# Altium schematic sheet ALU_ZF.SchDoc
size B; Author: E. Sims; Organization: Let's Build Rockets Inc.; SheetNumber: 16; SheetTotal: 16
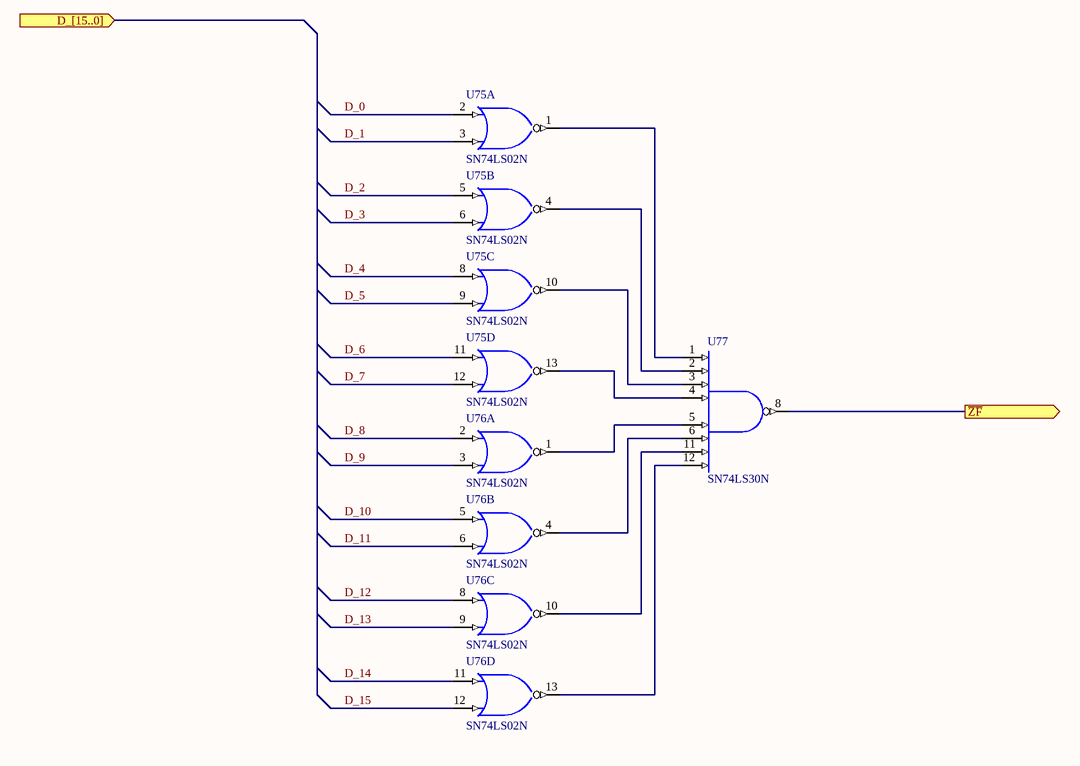
[diagram p0: ALU_ZF.SchDoc]

## Parts
U75  SN74LS02N  [N014]  (parts A,B,C,D of 4)
U76  SN74LS02N  [N014]  (parts A,B,C,D of 4)
U77  SN74LS30N  [N014]

## Ports
D_[15..0] (in), ~{ZF} (out)

## Nets
GND: U75.7(GND) U76.7(GND) U77.7(GND)
VCC: U75.14(VCC) U76.14(VCC) U77.14(VCC)
D_0: U75.2(A)
D_1: U75.3(B)
D_2: U75.5(A)
D_3: U75.6(B)
D_4: U75.8(A)
D_5: U75.9(B)
D_6: U75.11(A)
D_7: U75.12(B)
D_8: U76.2(A)
D_9: U76.3(B)
D_10: U76.5(A)
D_11: U76.6(B)
D_12: U76.8(A)
D_13: U76.9(B)
D_14: U76.11(A)
D_15: U76.12(B)
~{ZF}: U77.8(Y) ; port ~{ZF}
NetU75_1: U75.1(Y) U77.1(A)
NetU75_4: U75.4(Y) U77.2(B)
NetU75_10: U75.10(Y) U77.3(C)
NetU75_13: U75.13(Y) U77.4(D)
NetU76_1: U76.1(Y) U77.5(E)
NetU76_4: U76.4(Y) U77.6(F)
NetU76_10: U76.10(Y) U77.11(G)
NetU76_13: U76.13(Y) U77.12(H)

## Notes on the sheet
- Let's Build Rocket's Inc. Modular Paylaod System Based on TMP-010 Rev
  For more information visit https://github.com/LetsBuildRockets/Modular-Payload-System
  This work is licensed under CC BY-NC 4.0. To view a copy of this license, visit https://creativecommons.org/licenses/by-nc/4.0
- Title
- Size:
- Date:
- Assembly Variant:
- B
- Number:
- Time:
- Revision:
- Sheet
- of
- Author:
- File:

## Library data of the parts
U75 U76 = SN74LS02N: Quadruple 2-Input Positive-NOR Gate; Published: 8-Jun-2000; LatestRevisionDate: 04-Mar-2005; LatestRevisionNote: Stylized 3D Model Added.; DatasheetVersion: Mar-1988; PackageVersion: Oct-1995; PackageReference: N014; Publisher: Altium Limited; PackageDescription: DIP; 14 Leads; Row Spacing 7.62 mm; Pitch 2.54 mm; ComponentLink1Description: Manufacturer Link; ComponentLink1URL: http://www.ti.com/; ComponentLink2Description: Datasheet; ComponentLink2URL: http://www-s.ti.com/sc/ds/sn54s02.pdf
U77 = SN74LS30N: 8-Input Positive-NAND Gate; Note: Pins 9, 10  and 13 are NC & not drawn.; Published: 8-Jun-2000; LatestRevisionDate: 04-Mar-2005; LatestRevisionNote: Stylized 3D Model Added.; DatasheetVersion: Mar-1988; PackageVersion: Oct-1995; PackageReference: N014; Publisher: Altium Limited; PackageDescription: DIP; 14 Leads; Row Spacing 7.62 mm; Pitch 2.54 mm; ComponentLink1Description: Manufacturer Link; ComponentLink1URL: http://www.ti.com/; ComponentLink2Description: Datasheet; ComponentLink2URL: http://www-s.ti.com/sc/ds/sn74s30.pdf